# EAGLE design M710B (EAGLE 6.6.0)
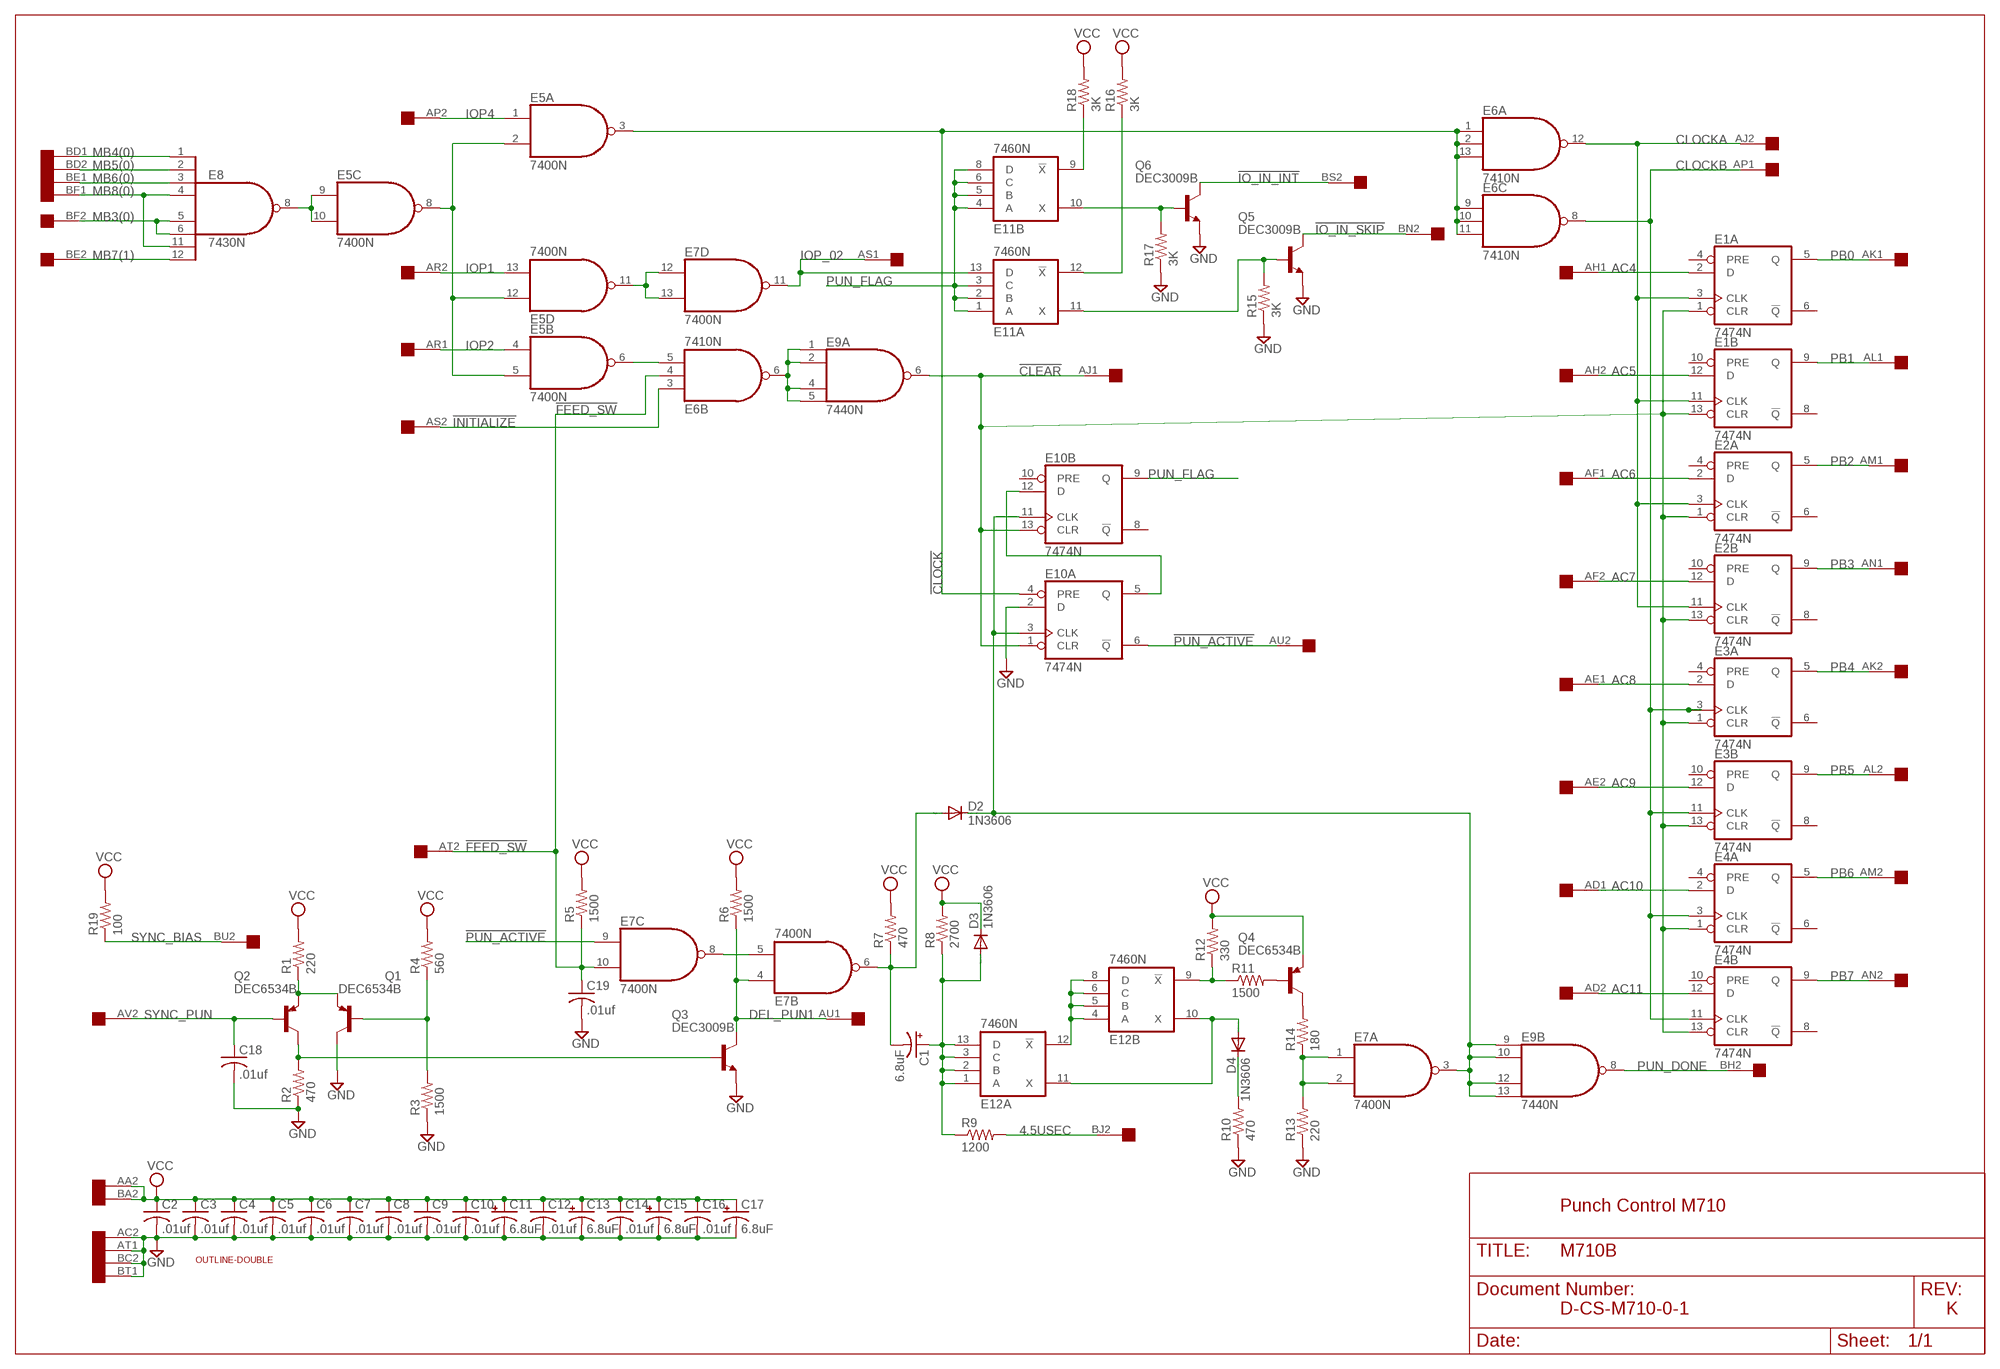
[diagram p0: schematic, sheet 1]

## Parts
C1  6.8uF  CPOL-USE15-5AXIAL  [E15-5]
C2  .01uf  C-US075-032X103  [C075-032X103]
C3  .01uf  C-US075-032X103  [C075-032X103]
C4  .01uf  C-US075-032X103  [C075-032X103]
C5  .01uf  C-US075-032X103  [C075-032X103]
C6  .01uf  C-US075-032X103  [C075-032X103]
C7  .01uf  C-US075-032X103  [C075-032X103]
C8  .01uf  C-US075-032X103  [C075-032X103]
C9  .01uf  C-US075-032X103  [C075-032X103]
C10  .01uf  C-US075-032X103  [C075-032X103]
C11  6.8uF  CPOL-USE15-5AXIAL  [E15-5]
C12  .01uf  C-US075-032X103  [C075-032X103]
C13  6.8uF  CPOL-USE15-5AXIAL  [E15-5]
C14  .01uf  C-US075-032X103  [C075-032X103]
C15  6.8uF  CPOL-USE15-5AXIAL  [E15-5]
C16  .01uf  C-US075-032X103  [C075-032X103]
C17  6.8uF  CPOL-USE15-5AXIAL  [E15-5]
C18  .01uf  C-US075-032X103  [C075-032X103]
C19  .01uf  C-US075-032X103  [C075-032X103]
D2  1N3606  DIODE-SOD61B  [SOD61B]
D3  1N3606  DIODE-SOD61B  [SOD61B]
D4  1N3606  DIODE-SOD61B  [SOD61B]
E1  7474N  74S74N  [DIL14]
E2  7474N  74S74N  [DIL14]
E3  7474N  74S74N  [DIL14]
E4  7474N  74S74N  [DIL14]
E5  7400N  [DIL14]
E6  7410N  [DIL14]
E7  7400N  [DIL14]
E8  7430N  [DIL14]
E9  7440N  [DIL14]
E10  7474N  74S74N  [DIL14]
E11  7460N  [DIL14]
E12  7460N  [DIL14]
Q1  DEC6534B  BC327-16-PNP-TO92-EBC  [TO92-EBC]
Q2  DEC6534B  BC327-16-PNP-TO92-EBC  [TO92-EBC]
Q3  DEC3009B  92-NPN-TO92-EBC  [TO92-EBC]
Q4  DEC6534B  BC327-16-PNP-TO92-EBC  [TO92-EBC]
Q5  DEC3009B  92-NPN-TO92-EBC  [TO92-EBC]
Q6  DEC3009B  -NPN-TO92-EBC  [TO92-EBC]
R1  220  R-US_0207/15  [0207/15]
R2  470  R-US_0207/15  [0207/15]
R3  1500  R-US_0207/15  [0207/15]
R4  560  R-US_0207/15  [0207/15]
R5  1500  R-US_0207/15  [0207/15]
R6  1500  R-US_0207/15  [0207/15]
R7  470  R-US_0207/15  [0207/15]
R8  2700  R-US_0207/15  [0207/15]
R9  1200  R-US_0207/15  [0207/15]
R10  470  R-US_0207/15  [0207/15]
R11  1500  R-US_0207/15  [0207/15]
R12  330  R-US_0207/15  [0207/15]
R13  220  R-US_0207/15  [0207/15]
R14  180  R-US_0207/15  [0207/15]
R15  3K  R-US_0207/15  [0207/15]
R16  3K  R-US_0207/15  [0207/15]
R17  3K  R-US_0207/15  [0207/15]
R18  3K  R-US_0207/15  [0207/15]
R19  100  R-US_0207/15  [0207/15]
U$1  OUTLINE-DOUBLE  [DOUBLE]
U$2  DOUBLE  [EDGE-CON4]

## Nets
4.5USEC: R9.2 U$2.BJ2
!CLEAR: E1.1(A:CLR) E1.13(B:CLR) E2.1(A:CLR) E2.13(B:CLR) E3.1(A:CLR) E3.13(B:CLR) E4.1(A:CLR) E4.13(B:CLR) E9.6(A:O) E10.1(A:CLR) E10.13(B:CLR) U$2.AJ1
!CLOCK: E5.3(A:O) E6.1(A:I0) E6.2(A:I1) E6.9(C:I0) E6.10(C:I1) E6.11(C:I2) E6.13(A:I2) E10.4(A:PRE)
!FEED_SW: C19.1 E6.4(B:I1) E7.10(C:I1) R5.1 U$2.AT2
!INITIALIZE: E6.3(B:I0) U$2.AS2
!IO_IN_INT: Q6.C U$2.BS2
!IO_IN_SKIP: Q5.C U$2.BN2
!PUN_ACTIVE: E7.9(C:I0) E10.6(A:!Q) U$2.AU2
AC4: E1.2(A:D) U$2.AH1
AC5: E1.12(B:D) U$2.AH2
AC6: E2.2(A:D) U$2.AF1
AC7: E2.12(B:D) U$2.AF2
AC8: E3.2(A:D) U$2.AE1
AC9: E3.12(B:D) U$2.AE2
AC10: E4.2(A:D) U$2.AD1
AC11: E4.12(B:D) U$2.AD2
CLOCKA: E1.3(A:CLK) E1.11(B:CLK) E2.3(A:CLK) E2.11(B:CLK) E6.12(A:O) U$2.AJ2
CLOCKB: E3.3(A:CLK) E3.11(B:CLK) E4.3(A:CLK) E4.11(B:CLK) E6.8(C:O) U$2.AP1
DEL_PUN1: E7.4(B:I0) Q3.C R6.1 U$2.AU1
GND [supply]: C2.2 C3.2 C4.2 C5.2 C6.2 C7.2 C8.2 C9.2 C10.2 C11.- C12.2 C13.- C14.2 C15.- C16.2 C17.- C18.2 C19.2 E10.2(A:D) Q1.C Q3.E Q5.E Q6.E R2.1 R3.1 R10.1 R13.1 R15.1 R17.1 U$2.AC2 U$2.AT1 U$2.BC2 U$2.BT1
IOP1: E5.13(D:I1) U$2.AR2
IOP2: E5.4(B:I0) U$2.AR1
IOP4: E5.1(A:I0) U$2.AP2
IOP_02: E7.11(D:O) E11.13(A:D) U$2.AS1
MB3(0): E8.5(I4) E8.6(I5) U$2.BF2
MB4(0): E8.1(I0) U$2.BD1
MB5(0): E8.2(I1) U$2.BD2
MB6(0): E8.3(I2) U$2.BE1
MB7(1): E8.12(I7) U$2.BE2
MB8(0): E8.4(I3) E8.11(I6) U$2.BF1
N$1: D2.C E7.3(A:O) E9.9(B:I0) E9.10(B:I1) E9.12(B:I2) E9.13(B:I3) E10.3(A:CLK) E10.11(B:CLK)
N$2: E6.6(B:O) E9.1(A:I0) E9.2(A:I1) E9.4(A:I2) E9.5(A:I3)
N$3: E12.4(B:A) E12.5(B:B) E12.6(B:C) E12.8(B:D) E12.12(A:!X)
N$4: C1.+ D3.A E12.1(A:A) E12.2(A:B) E12.3(A:C) E12.13(A:D) R8.1 R9.1
N$5: E5.9(C:I0) E5.10(C:I1) E8.8(O)
N$6: D4.A E12.10(B:X) E12.11(A:X)
N$7: E5.6(B:O) E6.5(B:I2)
N$8: E5.2(A:I1) E5.5(B:I1) E5.8(C:O) E5.12(D:I0)
N$9: E11.9(B:!X) R18.1
N$10: E11.12(A:!X) R16.1
N$11: E11.11(A:X) Q5.B R15.2
N$12: E11.10(B:X) Q6.B R17.2
N$13: D4.C R10.2
N$14: Q4.B R11.2
N$16: E5.11(D:O) E7.12(D:I0) E7.13(D:I1)
N$17: Q1.B R3.2 R4.1
N$18: Q2.C Q3.B R2.2
N$19: E12.9(B:!X) R11.1 R12.1
N$20: Q4.C R14.2
N$21: E7.1(A:I0) E7.2(A:I1) R13.2 R14.1
N$22: E7.5(B:I1) E7.8(C:O)
N$23: C1.- D2.A E7.6(B:O) R7.1
N$26: E10.5(A:Q) E10.12(B:D)
N$36: Q1.E Q2.E R1.1
PB0: E1.5(A:Q) U$2.AK1
PB1: E1.9(B:Q) U$2.AL1
PB2: E2.5(A:Q) U$2.AM1
PB3: E2.9(B:Q) U$2.AN1
PB4: E3.5(A:Q) U$2.AK2
PB5: E3.9(B:Q) U$2.AL2
PB6: E4.5(A:Q) U$2.AM2
PB7: E4.9(B:Q) U$2.AN2
PUN_DONE: E9.8(B:O) U$2.BH2
PUN_FLAG: E10.9(B:Q) E11.1(A:A) E11.2(A:B) E11.3(A:C) E11.4(B:A) E11.5(B:B) E11.6(B:C) E11.8(B:D)
SYNC_BIAS: R19.1 U$2.BU2
SYNC_PUN: C18.1 Q2.B U$2.AV2
VCC [supply]: C2.1 C3.1 C4.1 C5.1 C6.1 C7.1 C8.1 C9.1 C10.1 C11.+ C12.1 C13.+ C14.1 C15.+ C16.1 C17.+ D3.C Q4.E R1.2 R4.2 R5.2 R6.2 R7.2 R8.2 R12.2 R16.2 R18.2 R19.2 U$2.AA2 U$2.BA2
Unconnected: E1.4(A:PRE) E1.6(A:!Q) E1.8(B:!Q) E1.10(B:PRE) E2.4(A:PRE) E2.6(A:!Q) E2.8(B:!Q) E2.10(B:PRE) E3.4(A:PRE) E3.6(A:!Q) E3.8(B:!Q) E3.10(B:PRE) E4.4(A:PRE) E4.6(A:!Q) E4.8(B:!Q) E4.10(B:PRE) E9.3(3:NC) E9.11(11:NC) E10.8(B:!Q) E10.10(B:PRE) U$2.AA1 U$2.AB1 U$2.AB2 U$2.AC1 U$2.AV1 U$2.BA1 U$2.BB1 U$2.BB2 U$2.BC1 U$2.BH1 U$2.BJ1 U$2.BK1 U$2.BK2 U$2.BL1 U$2.BL2 U$2.BM1 U$2.BM2 U$2.BN1 U$2.BP1 U$2.BP2 U$2.BR1 U$2.BR2 U$2.BS1 U$2.BT2 U$2.BU1 U$2.BV1 U$2.BV2

## Notes on the sheet
- Punch Control M710
- D-CS-M710-0-1 | K

## Power pins joined to a net without a drawn wire
GND: E1.7(P:GND) E2.7(P:GND) E3.7(P:GND) E4.7(P:GND) E5.7(P:GND) E6.7(P:GND) E7.7(P:GND) E8.7(GND) E9.7(P:GND) E10.7(P:GND) E11.7(P:GND) E12.7(P:GND)
VCC: E1.14(P:VCC) E2.14(P:VCC) E3.14(P:VCC) E4.14(P:VCC) E5.14(P:VCC) E6.14(P:VCC) E7.14(P:VCC) E8.14(VCC) E9.14(P:VCC) E10.14(P:VCC) E11.14(P:VCC) E12.14(P:VCC)

## Library data of the parts
C1 C11 C13 C15 C17 = dec-con:CPOL-USE15-5AXIAL: 0.6" veresion of an electrolytic
C2-C10 C12 C14 C16 C18 C19 = rcl:C-US: CAPACITOR, American symbol
D2-D4 = diode:DIODE-: DIODE
E1-E4 E10 = 74xx-us:74*74: Dual D type positive edge triggered FLIP FLOP, preset and clear
E5 E7 = 74xx-us:74*00: Quad 2-input NAND gate
E6 = 74xx-us:74*10: Triple 3-input NAND gate
E8 = 74xx-us:74*30: 8-input NAND gate
E9 = dec-con:74*40: Dual 4-input NAND gate
E11 E12 = 74xx-us:74*60: Dual 4-input EXPANDER
Q1 Q2 Q4 = transistor:*-PNP-: PNP Transistror
Q3 Q5 Q6 = transistor:*-NPN-: NPN Transistror BF959 corrected 2008.03.06
R1-R19 = rcl:R-US_: RESISTOR, American symbol
U$1 = dec-con:OUTLINE-*: Board outlines for DEC boards.
U$2 = dec-con:DOUBLE: Double-Height DEC board

## Net classes
1 supply: width 0.813 mm

## Board
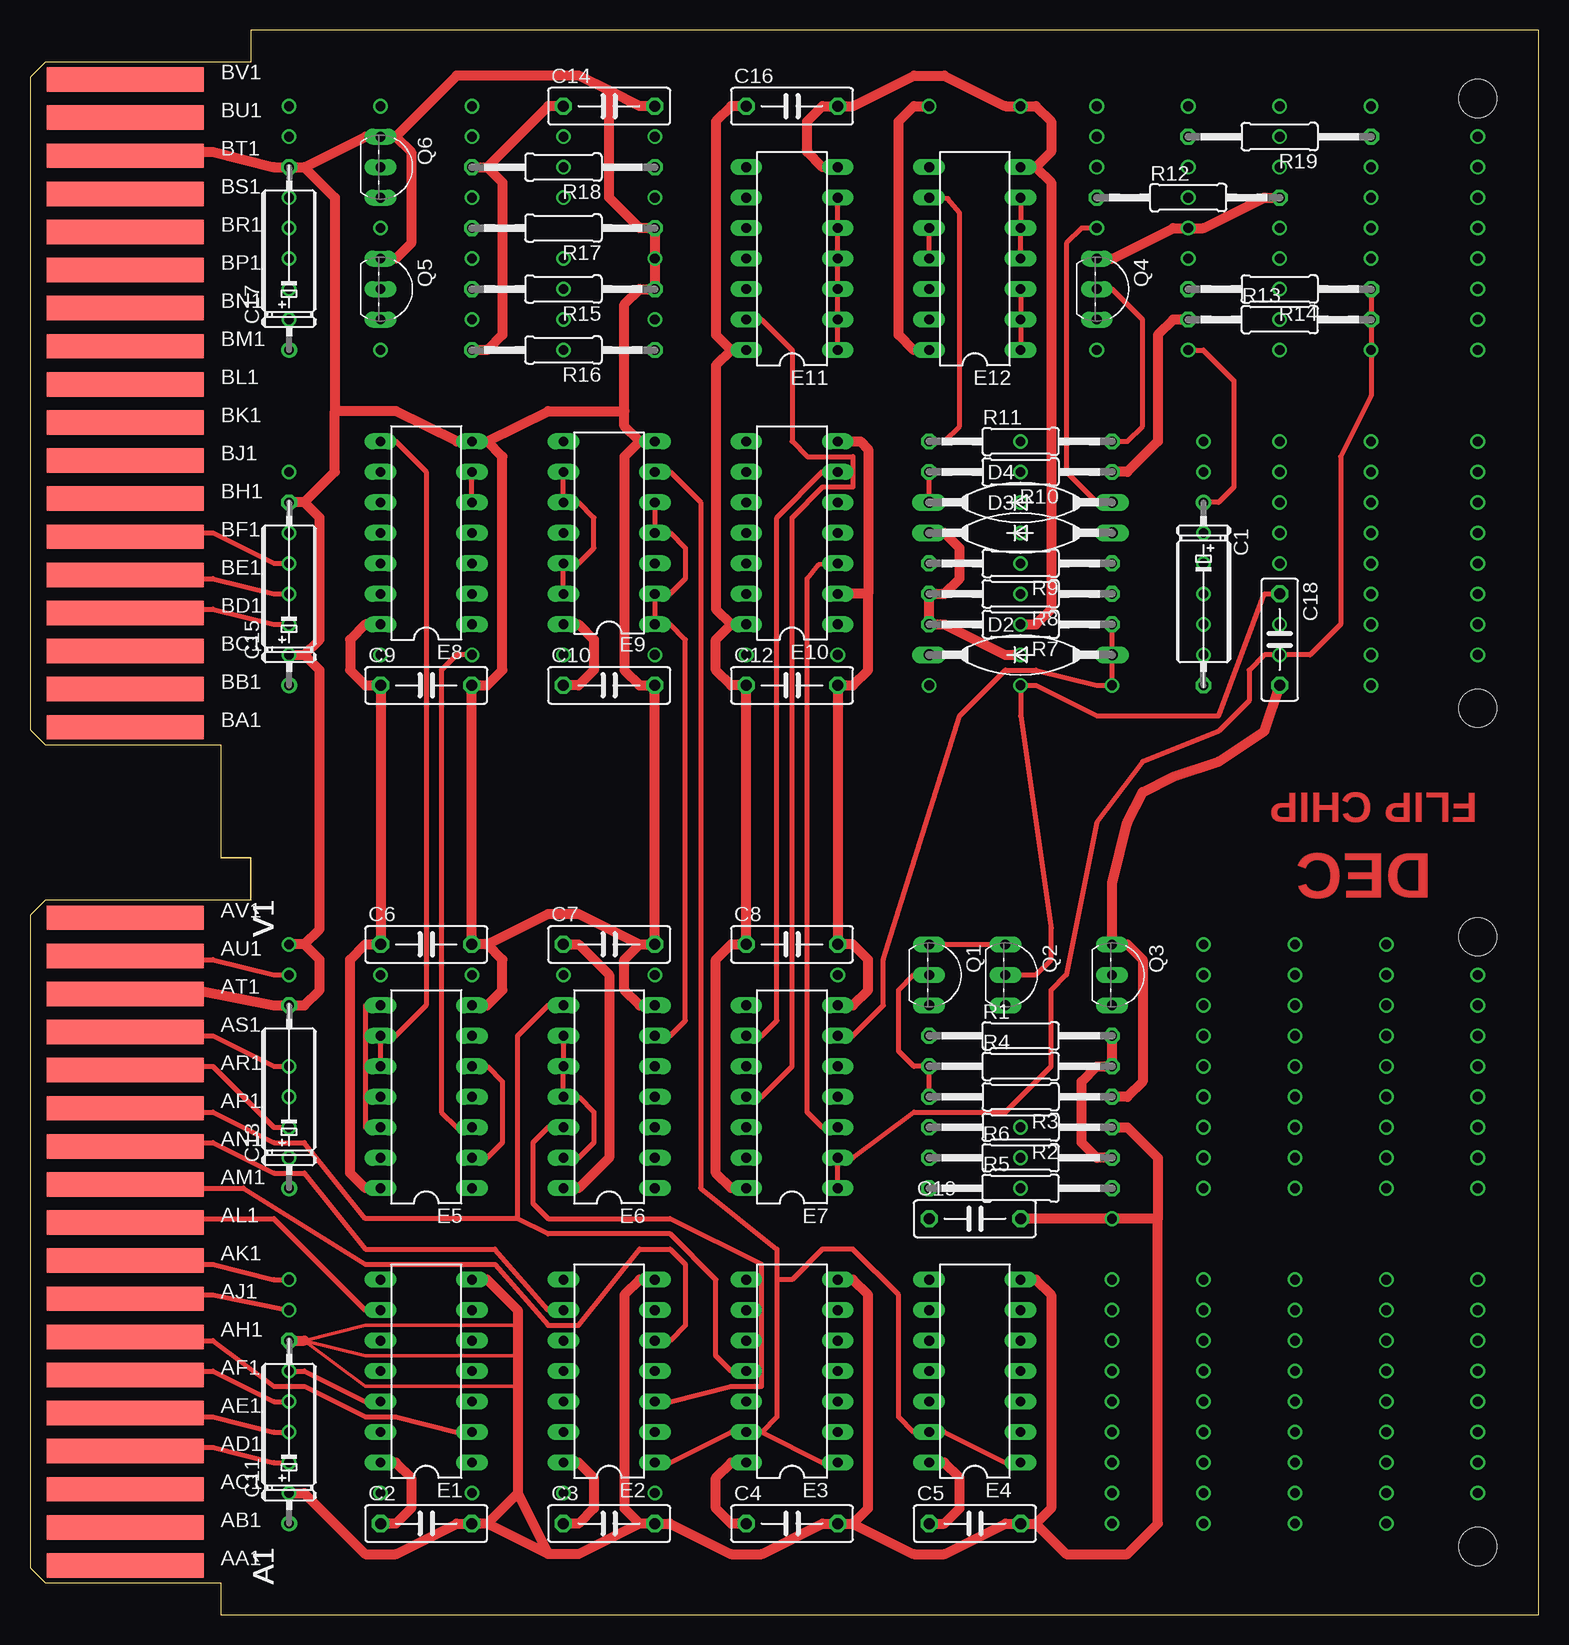
[diagram p1: board, top side]
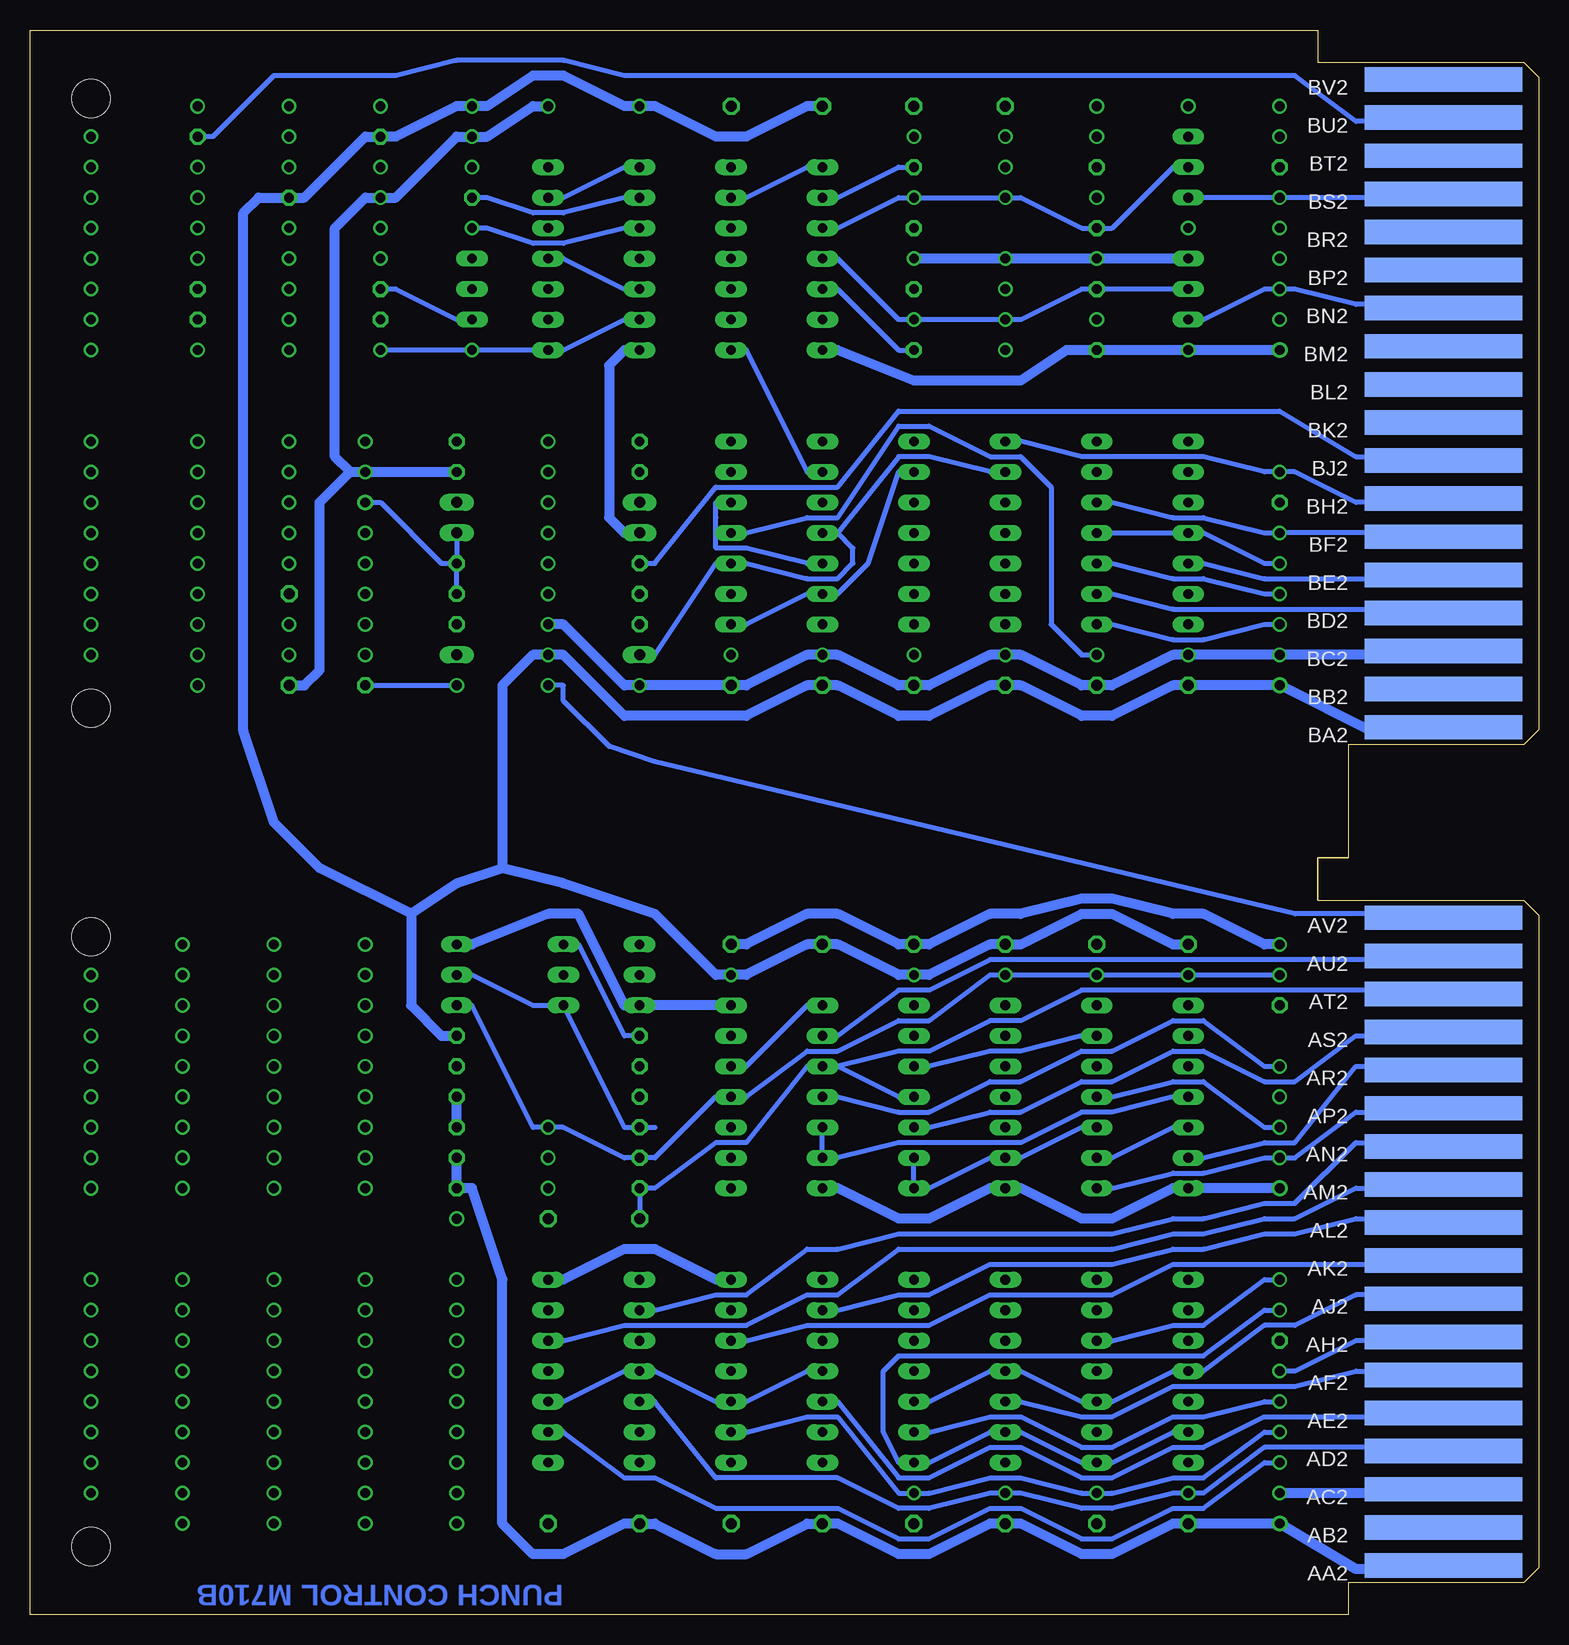
[diagram p2: board, bottom side, seen from below]

Size 125.73 x 132.08 mm. Coordinates in mm from the lower left corner, seen from the top.
Copper layers (1+16): Top 0.035mm / dielectric 1.5mm / Bottom 0.035mm
Design rules "16mils": minimum track width 16mil, minimum drill 32mil, track to track 15mil, track to pad 10mil, pad to pad 10mil, via to via 10mil, smd to smd 10mil, copper to edge 13mil, drill to drill 10mil, minimum pad ring 10mil, minimum via ring 8mil, stop-mask expansion 0mil, vias tented up to drill 0mil, thermal gap 10mil
vRestrict: area 31.8,108 to 41.9,125.7; area 49.5,108 to 59.7,125.7; area 67.3,108 to 77.5,125.7; area 85.1,108 to 95.3,125.7; area 102.9,108 to 113,125.7; area 31.8,80 to 41.9,97.8; area 49.5,80 to 59.7,97.8; area 67.3,80 to 77.5,97.8; area 85.1,80 to 95.3,97.8; area 31.8,34.3 to 41.9,52.1; area 49.5,34.3 to 59.7,52.1; area 67.3,34.3 to 77.5,52.1; area 85.1,34.3 to 95.3,52.1; area 102.9,11.4 to 113,29.2; area 85.1,11.4 to 95.3,29.2; area 49.5,11.4 to 59.7,29.2; area 31.8,11.4 to 41.9,29.2; area 67.3,11.4 to 77.5,29.2

### Footprints (pad centres in the part's own frame; a part is rotated, then mirrored left to right if it is on the bottom)
E15-5 = drill 0.813: + -7.62,0 | drill 0.813 octagon: - 7.62,0
C075-032X103 = drill 0.914 octagon: 1 -3.81,0; 2 3.81,0
SOD61B = drill 0.914 long: A 7.62,0; C -7.62,0
DIL14 = drill 0.813 long: 1 -7.62,-3.81; 2 -5.08,-3.81; 3 -2.54,-3.81; 4 0,-3.81; 5 2.54,-3.81; 6 5.08,-3.81; 7 7.62,-3.81; 8 7.62,3.81; 9 5.08,3.81; 10 2.54,3.81; 11 0,3.81; 12 -2.54,3.81; 13 -5.08,3.81; 14 -7.62,3.81
TO92-EBC = drill 0.813 long: B 0,-1.27; C 2.54,-1.27; E -2.54,-1.27
0207/15 = drill 0.813 octagon: 1 -7.62,0; 2 7.62,0
DOUBLE = hole 3.175: 120.65,56.515; 120.65,5.715; 120.65,75.565; 120.65,126.365
EDGE-CON4 = smd 13.106 x 2.032: AA1 7.938,4.128; AB1 7.938,7.303; AC1 7.938,10.477; AD1 7.938,13.652; AE1 7.938,16.828; AF1 7.938,20.003; AH1 7.938,23.177; AJ1 7.938,26.352; AK1 7.938,29.527; AL1 7.938,32.703; AM1 7.938,35.877; AN1 7.938,39.053; AP1 7.938,42.227; AR1 7.938,45.403; AS1 7.938,48.578; AT1 7.938,51.752; AU1 7.938,54.928; AV1 7.938,58.102; BA1 7.938,73.978; BB1 7.938,77.153; BC1 7.938,80.328; BD1 7.938,83.502; BE1 7.938,86.677; BF1 7.938,89.853; BH1 7.938,93.028; BJ1 7.938,96.203; BK1 7.938,99.377; BL1 7.938,102.552; BM1 7.938,105.728; BN1 7.938,108.903; BP1 7.938,112.078; BR1 7.938,115.252; BS1 7.938,118.427; BT1 7.938,121.603; BU1 7.938,124.778; BV1 7.938,127.953 | smd 13.106 x 2.032 bottom: AA2 7.938,4.128; AB2 7.938,7.303; AC2 7.938,10.477; AD2 7.938,13.652; AE2 7.938,16.828; AF2 7.938,20.003; AH2 7.938,23.177; AJ2 7.938,26.352; AK2 7.938,29.527; AL2 7.938,32.703; AM2 7.938,35.877; AN2 7.938,39.053; AP2 7.938,42.227; AR2 7.938,45.403; AS2 7.938,48.578; AT2 7.938,51.752; AU2 7.938,54.928; AV2 7.938,58.102; BA2 7.938,73.978; BB2 7.938,77.153; BC2 7.938,80.328; BD2 7.938,83.502; BE2 7.938,86.677; BF2 7.938,89.853; BH2 7.938,93.028; BJ2 7.938,96.203; BK2 7.938,99.377; BL2 7.938,102.552; BM2 7.938,105.728; BN2 7.938,108.903; BP2 7.938,112.078; BR2 7.938,115.252; BS2 7.938,118.427; BT2 7.938,121.603; BU2 7.938,124.778; BV2 7.938,127.953

### Placement (x,y rotation side)
C1  97.79,85.09 270 top
C2  33.02,7.62 0 top
C3  48.26,7.62 0 top
C4  63.5,7.62 0 top
C5  78.74,7.62 0 top
C6  33.02,55.88 0 top
C7  48.26,55.88 0 top
C8  63.5,55.88 0 top
C9  33.02,77.47 0 top
C10  48.26,77.47 0 top
C11  21.59,15.24 90 top
C12  63.5,77.47 0 top
C13  21.59,43.18 90 top
C14  48.26,125.73 0 top
C15  21.59,85.09 90 top
C16  63.5,125.73 0 top
C17  21.59,113.03 90 top
C18  104.14,81.28 270 top
C19  78.74,33.02 0 top
D2  82.55,80.01 0 top
D3  82.55,90.17 0 top
D4  82.55,92.71 0 top
E1  33.02,20.32 90 top
E2  48.26,20.32 90 top
E3  63.5,20.32 90 top
E4  78.74,20.32 90 top
E5  33.02,43.18 90 top
E6  48.26,43.18 90 top
E7  63.5,43.18 90 top
E8  33.02,90.17 90 top
E9  48.26,90.17 90 top
E10  63.5,90.17 90 top
E11  63.5,113.03 90 top
E12  78.74,113.03 90 top
Q1  76.2,53.34 270 top
Q2  82.55,53.34 270 top
Q3  91.44,53.34 270 top
Q4  90.17,110.49 270 top
Q5  30.48,110.49 270 top
Q6  30.48,120.65 270 top
R1  82.55,48.26 0 top
R2  82.55,40.64 180 top
R3  82.55,43.18 180 top
R4  82.55,45.72 0 top
R5  82.55,35.56 0 top
R6  82.55,38.1 0 top
R7  82.55,82.55 180 top
R8  82.55,85.09 180 top
R9  82.55,87.63 180 top
R10  82.55,95.25 180 top
R11  82.55,97.79 0 top
R12  96.52,118.11 0 top
R13  104.14,107.95 0 top
R14  104.14,110.49 180 top
R15  44.45,110.49 180 top
R16  44.45,105.41 180 top
R17  44.45,115.57 180 top
R18  44.45,120.65 180 top
R19  104.14,123.19 180 top
U$1  0,0 0 top
U$2  0,0 0 top

### Tracks (layer width: path | path; a pad name or v marks a point on that pad's centre or on a via)
4.5USEC
  Bottom 0.406: R9.2 73.66,87.63 68.58,93.98 58.42,93.98 53.34,100.33 21.59,100.33 15.24,96.52 8.89,96.52 U$2.BJ2
!CLEAR  (via drill 0.81)
  Top 0.406: U$2.AJ1 8.89,26.67 15.24,26.67 v21.59,25.4 | E2.1 53.34,12.7 58.42,15.24 E3.13 60.96,15.24 | E9.6 53.34,95.25 55.88,92.71 55.88,35.56 62.23,30.48 62.23,27.94 | 62.23,27.94 62.23,16.51 60.96,15.24 | E3.1 66.04,12.7 60.96,15.24 | 62.23,27.94 63.5,27.94 66.04,30.48 68.58,30.48 72.39,26.67 72.39,16.51 73.66,15.24 E4.13 76.2,15.24 81.28,12.7 E4.1
  Bottom 0.406: E1.13 30.48,15.24 35.56,12.7 E1.1 38.1,12.7 43.18,15.24 E2.13 45.72,15.24 50.8,12.7 E2.1 53.34,12.7 54.61,15.24 54.61,20.32 53.34,21.59 27.94,21.59 22.86,25.4 v21.59,25.4 | E10.1 66.04,82.55 60.96,85.09 E10.13 58.42,85.09 55.88,87.63 53.34,95.25 E9.6
!CLOCK  (via drill 0.81)
  Top 0.406: E6.9 E6.10 E6.11 45.72,43.18 46.99,41.91 46.99,39.37 45.72,38.1 E6.13 | v36.83,80.01 35.56,80.01 34.29,78.74 34.29,41.91 35.56,40.64 E5.3
  Bottom 0.406: E10.4 66.04,90.17 60.96,91.44 58.42,91.44 53.34,99.06 50.8,99.06 45.72,96.52 43.18,96.52 40.64,93.98 40.64,82.55 38.1,80.01 v36.83,80.01 | E5.3 38.1,40.64 43.18,38.1 E6.13 45.72,38.1 50.8,35.56 E6.1 E6.2
!FEED_SW
  Bottom 0.406: U$2.AT2 8.89,52.07 38.1,52.07 43.18,49.53 45.72,49.53 50.8,46.99 53.34,46.99 58.42,45.72 | 58.42,45.72 E7.10 60.96,45.72 66.04,39.37 68.58,39.37 73.66,35.56 R5.1 C19.1 | E6.4 53.34,43.18 58.42,45.72
!INITIALIZE
  Bottom 0.406: E6.3 50.8,40.64 45.72,41.91 43.18,41.91 38.1,44.45 35.56,44.45 30.48,46.99 27.94,46.99 22.86,44.45 20.32,44.45 15.24,48.26 8.89,48.26 U$2.AS2
!IO_IN_INT  (via drill 0.81)
  Bottom 0.406: U$2.BS2 10.16,118.11 v21.59,118.11 Q6.C
!IO_IN_SKIP  (via drill 0.81)
  Bottom 0.406: U$2.BN2 8.89,109.22 15.24,109.22 20.32,110.49 v21.59,110.49 22.86,110.49 27.94,107.95 Q5.C
!PUN_ACTIVE
  Top 0.406: E7.9 60.96,48.26 62.23,49.53 62.23,91.44 66.04,95.25 E10.6
  Bottom 0.406: U$2.AU2 10.16,54.61 45.72,54.61 50.8,52.07 53.34,52.07 58.42,48.26 E7.9
AC4
  Top 0.406: U$2.AH1 8.89,22.86 15.24,22.86 20.32,19.05 22.86,19.05 27.94,16.51 30.48,16.51 35.56,15.24 E1.2
AC5  (via drill 0.81)
  Top 0.406: v21.59,20.32 22.86,20.32 27.94,17.78 E1.12
  Bottom 0.406: U$2.AH2 10.16,22.86 15.24,22.86 20.32,20.32 v21.59,20.32
AC6  (via drill 0.81)
  Top 0.406: U$2.AF1 8.89,20.32 15.24,20.32 20.32,17.78 v21.59,17.78
  Bottom 0.406: E2.2 50.8,15.24 45.72,16.51 43.18,16.51 38.1,13.97 35.56,13.97 30.48,16.51 27.94,16.51 22.86,17.78 v21.59,17.78
AC7
  Bottom 0.406: E2.12 43.18,17.78 38.1,16.51 35.56,16.51 30.48,19.05 20.32,19.05 15.24,20.32 8.89,20.32 U$2.AF2
AC8  (via drill 0.81)
  Top 0.406: U$2.AE1 8.89,16.51 15.24,16.51 20.32,15.24 v21.59,15.24
  Bottom 0.406: E3.2 66.04,15.24 60.96,16.51 58.42,16.51 53.34,10.16 v52.07,10.16 50.8,10.16 45.72,11.43 43.18,11.43 38.1,10.16 v36.83,10.16 35.56,10.16 30.48,11.43 27.94,11.43 22.86,15.24 v21.59,15.24
AC9
  Bottom 0.406: E3.12 58.42,17.78 53.34,11.43 50.8,11.43 45.72,13.97 43.18,13.97 38.1,11.43 35.56,11.43 30.48,13.97 27.94,13.97 22.86,16.51 8.89,16.51 U$2.AE2
AC10  (via drill 0.81)
  Top 0.406: U$2.AD1 8.89,13.97 15.24,13.97 20.32,12.7 v21.59,12.7
  Bottom 0.406: E4.2 81.28,15.24 76.2,11.43 73.66,11.43 68.58,8.89 58.42,8.89 53.34,6.35 50.8,6.35 45.72,8.89 43.18,8.89 38.1,6.35 35.56,6.35 30.48,8.89 27.94,8.89 22.86,12.7 v21.59,12.7
AC11  (via drill 0.81)
  Bottom 0.406: U$2.AD2 10.16,13.97 22.86,13.97 27.94,10.16 v29.21,10.16 30.48,10.16 35.56,8.89 38.1,8.89 43.18,10.16 v44.45,10.16 45.72,10.16 50.8,8.89 53.34,8.89 58.42,11.43 68.58,11.43 73.66,17.78 E4.12
CLOCKA
  Top 0.406: E6.12 43.18,40.64 41.91,39.37 41.91,34.29 43.18,33.02 53.34,33.02 60.96,29.21 60.96,19.05 58.42,19.05 53.34,17.78 E2.3
  Bottom 0.406: U$2.AJ2 10.16,26.67 15.24,26.67 20.32,24.13 22.86,24.13 27.94,20.32 E1.11 30.48,20.32 35.56,17.78 E1.3 38.1,17.78 43.18,20.32 E2.11 45.72,20.32 50.8,17.78 E2.3
CLOCKB
  Top 0.406: U$2.AP1 8.89,41.91 15.24,41.91 20.32,39.37 22.86,39.37 27.94,33.02 40.64,33.02 | E3.11 58.42,20.32 57.15,21.59 57.15,27.94 53.34,31.75 43.18,31.75 40.64,33.02 | 40.64,33.02 40.64,48.26 43.18,50.8 E6.8
  Bottom 0.406: E4.3 81.28,17.78 76.2,20.32 E4.11 73.66,20.32 68.58,17.78 E3.3 66.04,17.78 60.96,20.32 E3.11
DEL_PUN1  (via drill 0.81)
  Top 0.406: U$2.AU1 10.16,54.61 15.24,54.61 20.32,53.34 v21.59,53.34
  Bottom 0.406: v21.59,53.34 v29.21,53.34 v36.83,53.34 v44.45,53.34 45.72,53.34 50.8,49.53 53.34,49.53 58.42,46.99 60.96,46.99 66.04,43.18 E7.4 68.58,43.18 73.66,38.1 R6.1 76.2,38.1 81.28,40.64 v82.55,40.64 83.82,40.64 88.9,50.8 Q3.C
GND  (via drill 0.81)
  Top 0.305: 22.86,22.86 27.94,24.13 40.64,24.13 | 22.86,22.86 27.94,21.59 40.64,21.59 | 22.86,22.86 27.94,19.05 40.64,19.05
  Top 0.813: U$2.BT1 8.89,121.92 15.24,121.92 20.32,120.65 C17.- 22.86,120.65 | 22.86,120.65 27.94,123.19 Q6.E 30.48,123.19 | 30.48,123.19 31.75,121.92 31.75,114.3 30.48,113.03 Q5.E | 30.48,123.19 35.56,128.27 45.72,128.27 48.26,127 | U$2.AT1 11.43,52.07 13.97,52.07 20.32,50.8 C13.- 22.86,50.8 24.13,52.07 24.13,54.61 22.86,55.88 | 22.86,55.88 v21.59,55.88 | E1.7 38.1,27.94 40.64,25.4 40.64,24.13 40.64,21.59 40.64,19.05 40.64,10.16 | 40.64,10.16 38.1,7.62 | 38.1,7.62 C2.2 35.56,7.62 30.48,5.08 27.94,5.08 22.86,10.16 v21.59,10.16 | 50.8,7.62 C3.2 53.34,7.62 58.42,5.08 60.96,5.08 66.04,7.62 C4.2 68.58,7.62 | 50.8,7.62 45.72,5.08 43.18,5.08 | 43.18,5.08 38.1,7.62 | 40.64,10.16 43.18,5.08 | 68.58,7.62 73.66,5.08 76.2,5.08 81.28,7.62 C5.2 83.82,7.62 | 68.58,7.62 69.85,8.89 69.85,26.67 68.58,27.94 E3.7 | 83.82,7.62 86.36,5.08 91.44,5.08 93.98,7.62 93.98,33.02 | 93.98,33.02 v90.17,33.02 C19.2 | R2.1 91.44,40.64 93.98,38.1 93.98,33.02 | R3.1 91.44,43.18 92.71,44.45 92.71,54.61 91.44,55.88 Q3.E 90.17,60.96 91.44,66.04 92.71,68.58 95.25,69.85 99.06,71.12 102.87,73.66 C18.2 | E4.7 83.82,27.94 85.09,26.67 85.09,8.89 83.82,7.62 | 22.86,55.88 24.13,57.15 24.13,78.74 22.86,80.01 | v21.59,80.01 22.86,80.01 | 22.86,80.01 24.13,81.28 24.13,91.44 22.86,92.71 | 22.86,92.71 C15.- | 22.86,92.71 25.4,95.25 25.4,100.33 | 25.4,100.33 30.48,100.33 35.56,97.79 E8.7 38.1,97.79 | 22.86,120.65 25.4,118.11 25.4,100.33 | C14.2 50.8,125.73 48.26,127 | 83.82,120.65 85.09,121.92 85.09,124.46 83.82,125.73 v82.55,125.73 81.28,125.73 76.2,128.27 73.66,128.27 68.58,125.73 C16.2 66.04,125.73 64.77,124.46 64.77,121.92 66.04,120.65 E11.7
  Top 0.813: 83.82,120.65 E12.7 | 83.82,120.65 85.09,119.38 85.09,83.82 83.82,82.55 v82.55,82.55 | E9.7 50.8,97.79 | 50.8,97.79 49.53,99.06 49.53,100.33 | 49.53,100.33 49.53,109.22 50.8,110.49 R15.1 v52.07,113.03 R17.1 50.8,115.57 48.26,118.11 48.26,127 | 38.1,97.79 43.18,100.33 49.53,100.33 | 69.85,85.09 69.85,78.74 68.58,77.47 C12.2 C8.2 68.58,55.88 69.85,54.61 69.85,52.07 68.58,50.8 E7.7 | 69.85,85.09 E10.2 | E10.7 69.22,97.79 69.85,97.16 69.85,85.09 | E5.7 38.1,50.8 39.37,52.07 39.37,54.61 38.1,55.88 | 38.1,55.88 C6.2 C9.2 38.1,77.47 39.37,78.74 39.37,96.52 38.1,97.79 | 38.1,55.88 43.18,58.42 45.72,58.42 50.8,55.88 | 50.8,55.88 C7.2 C10.2 50.8,77.47 49.53,78.74 49.53,96.52 50.8,97.79 | E2.7 50.8,27.94 49.53,26.67 49.53,8.89 50.8,7.62 | R13.1 95.25,107.95 93.98,106.68 93.98,97.79 91.44,95.25 R10.1 | E6.7 50.8,50.8 49.53,52.07 49.53,54.61 50.8,55.88 | C11.- 22.86,22.86
  Bottom 0.813: U$2.AC2 10.16,10.16 v21.59,10.16 | Q5.E v36.83,113.03 v44.45,113.03 v52.07,113.03 | E7.7 Q1.C 76.2,50.8 80.01,58.42 82.55,58.42 88.9,55.88 Q3.E | v21.59,55.88 22.86,55.88 27.94,58.42 30.48,58.42 35.56,59.69 38.1,59.69 43.18,58.42 45.72,58.42 50.8,55.88 C7.2 53.34,55.88 58.42,58.42 60.96,58.42 66.04,55.88 C8.2 | C18.2 102.87,77.47 101.6,78.74 101.6,92.71 99.06,95.25 | 99.06,95.25 v97.79,95.25 R10.1 | 99.06,95.25 100.33,96.52 100.33,115.57 97.79,118.11 v96.52,118.11 95.25,118.11 90.17,123.19 v88.9,123.19 87.63,123.19 83.82,125.73 v82.55,125.73 | U$2.BC2 10.16,80.01 v21.59,80.01 v29.21,80.01 30.48,80.01 35.56,77.47 C9.2 38.1,77.47 43.18,80.01 v44.45,80.01 45.72,80.01 50.8,77.47 C10.2 53.34,77.47 58.42,80.01 v59.69,80.01 60.96,80.01 66.04,77.47 C12.2 v74.93,77.47 76.2,77.47 81.28,82.55 v82.55,82.55 | E3.7 68.58,27.94 73.66,30.48 76.2,30.48 81.28,27.94 E4.7 | R2.1 R3.1
IOP1
  Bottom 0.406: E5.13 27.94,38.1 22.86,39.37 20.32,39.37 15.24,45.72 8.89,45.72 U$2.AR2
IOP2  (via drill 0.81)
  Top 0.406: U$2.AR1 10.16,45.72 15.24,45.72 20.32,40.64 v21.59,40.64
  Bottom 0.406: E5.4 35.56,43.18 30.48,44.45 27.94,44.45 22.86,40.64 v21.59,40.64
IOP4  (via drill 0.81)
  Bottom 0.406: E5.1 35.56,35.56 30.48,36.83 27.94,36.83 22.86,38.1 v21.59,38.1 20.32,38.1 15.24,41.91 8.89,41.91 U$2.AP2
IOP_02  (via drill 0.81)
  Top 0.406: U$2.AS1 8.89,48.26 15.24,48.26 20.32,45.72 v21.59,45.72 | E7.11 60.96,43.18 63.5,45.72 63.5,91.44 66.04,93.98 68.58,93.98 68.58,96.52 64.77,96.52 63.5,97.79 63.5,105.41 60.96,107.95 E11.13
  Bottom 0.406: E7.11 58.42,43.18 53.34,41.91 50.8,41.91 45.72,44.45 43.18,44.45 38.1,46.99 35.56,46.99 30.48,49.53 27.94,49.53 22.86,45.72 v21.59,45.72
MB3(0)  (via drill 0.81)
  Top 0.406: E8.5 E8.6
  Bottom 0.406: U$2.BF2 10.16,90.17 v21.59,90.17 22.86,90.17 27.94,91.44 30.48,91.44 35.56,92.71 E8.5
MB4(0)  (via drill 0.81)
  Top 0.406: U$2.BD1 8.89,83.82 15.24,83.82 20.32,82.55 v21.59,82.55
  Bottom 0.406: E8.1 35.56,82.55 30.48,81.28 27.94,81.28 22.86,82.55 v21.59,82.55
MB5(0)
  Bottom 0.406: E8.2 35.56,85.09 30.48,83.82 8.89,83.82 U$2.BD2
MB6(0)  (via drill 0.81)
  Top 0.406: U$2.BE1 8.89,86.36 15.24,86.36 20.32,85.09 v21.59,85.09
  Bottom 0.406: E8.3 35.56,87.63 30.48,86.36 27.94,86.36 22.86,85.09 v21.59,85.09
MB7(1)
  Bottom 0.406: E8.12 27.94,87.63 22.86,86.36 8.89,86.36 U$2.BE2
MB8(0)  (via drill 0.81)
  Top 0.406: U$2.BF1 8.89,90.17 15.24,90.17 20.32,87.63 v21.59,87.63
  Bottom 0.406: E8.4 E8.11 27.94,90.17 22.86,87.63 v21.59,87.63
N$1
  Top 0.406: E7.3 66.04,40.64 64.77,41.91 64.77,86.36 65.74,87.56 E10.3 | E9.13 E9.12 45.72,87.63 46.99,88.9 46.99,91.44 45.72,92.71 E9.10 E9.9
  Bottom 0.406: D2.C 73.66,80.01 68.58,87.63 E10.3 66.04,87.63 60.96,86.36 58.42,86.36 57.15,87.63 57.15,88.9 58.42,90.17 | 58.42,90.17 E10.11 | E9.9 45.72,95.25 50.8,96.52 53.34,96.52 58.42,90.17
N$2
  Top 0.406: E6.6 53.34,48.26 54.61,49.53 54.61,81.28 53.34,82.55 E9.1 E9.2 53.34,85.09 54.61,86.36 54.61,88.9 53.34,90.17 E9.4 E9.5
N$3
  Top 0.406: E12.6 E12.5 E12.4
  Bottom 0.406: E12.8 76.2,120.65 81.28,118.11 E12.6 | E12.12 76.2,110.49 81.28,113.03 E12.4
N$4  (via drill 0.81)
  Top 0.406: E12.3 E12.2 E12.1 | v96.52,105.41 97.79,105.41 100.33,102.87 100.33,93.98 99.06,92.71 C1.+
  Bottom 0.406: E12.13 76.2,107.95 81.28,105.41 E12.1 v88.9,105.41 v96.52,105.41 | C1.+ 96.52,92.71 91.44,87.63 R9.1 | R8.1 R9.1 | D3.A R9.1
N$5
  Top 0.406: E8.8 30.48,97.79 33.02,95.25 33.02,50.8 30.48,48.26 E5.9 E5.10
N$6  (via drill 0.81)
  Top 0.406: v88.9,115.57 87.63,115.57 86.36,114.3 86.36,95.25 88.9,92.71 D4.A | E12.11 E12.10
  Bottom 0.406: E12.10 76.2,115.57 81.28,114.3 83.82,114.3 87.63,115.57 v88.9,115.57
N$7
  Bottom 0.406: E5.6 38.1,48.26 43.18,46.99 45.72,46.99 50.8,45.72 E6.5
N$8
  Top 0.406: E5.5 38.1,45.72 39.37,44.45 39.37,39.37 38.1,38.1 E5.2 | E5.8 27.94,50.8 27.94,40.64 E5.12
  Bottom 0.406: E5.12 30.48,40.64 35.56,38.1 E5.2
N$9
  Bottom 0.406: E11.9 58.42,118.11 53.34,120.65 R18.1
N$10
  Bottom 0.406: E11.12 58.42,110.49 53.34,105.41 R16.1
N$11  (via drill 0.81)
  Bottom 0.406: Q5.B R15.2 38.1,110.49 43.18,107.95 v44.45,107.95 v52.07,107.95 53.34,107.95 58.42,113.03 E11.11
N$12  (via drill 0.81)
  Bottom 0.406: E11.10 58.42,115.57 53.34,118.11 v52.07,118.11 v44.45,118.11 43.18,118.11 38.1,115.57 R17.2 35.56,115.57 30.48,120.65 Q6.B
N$13
  Top 0.406: D4.C R10.2
N$14
  Top 0.406: R11.2 91.44,97.79 92.71,99.06 92.71,107.95 90.17,110.49 Q4.B
N$15  (via drill 0.81)
  other vias: 88.9,120.65
N$16
  Bottom 0.406: E5.11 30.48,43.18 35.56,41.91 38.1,41.91 43.18,39.37 53.34,39.37 58.42,38.1 E7.13 E7.12
N$17
  Top 0.406: R3.2 R4.1 73.66,45.72 72.39,46.99 72.39,52.07 73.66,53.34 Q1.B
N$18
  Bottom 0.406: Q3.B 88.9,53.34 83.82,50.8 Q2.C 76.2,40.64 R2.2 73.66,40.64
N$19
  Top 0.406: R11.1 76.2,97.79 77.47,99.06 77.47,116.84 76.5,118.03 E12.9
  Bottom 0.406: E12.9 76.2,118.11 81.28,116.84 83.82,116.84 87.63,118.11 R12.1
N$20
  Bottom 0.406: Q4.C 90.17,107.95 95.25,110.49 R14.2
N$21  (via drill 0.81)
  Top 0.406: R14.1 R13.2 v111.76,105.41 111.76,101.6 109.22,96.52 109.22,82.55 106.68,80.01 v104.14,80.01 102.87,80.01 101.6,78.74 101.6,76.2 99.06,73.66 92.71,71.12 88.9,66.04 86.36,53.34 85.09,52.07 85.09,45.72 81.28,41.91 73.66,41.91 68.58,38.1 E7.2 E7.1
N$22
  Bottom 0.406: E7.8 60.96,50.8 66.04,45.72 E7.5
N$23  (via drill 0.81)
  Top 0.406: R7.1 D2.A v90.17,77.47 88.9,77.47 83.82,78.74 81.28,78.74 77.47,74.93 71.12,54.61 71.12,50.8 68.58,48.26 E7.6
  Bottom 0.406: C1.- v90.17,77.47
N$24  (via drill 0.81)
  other vias: 96.52,125.73
N$25  (via drill 0.81)
  other vias: 104.14,125.73
N$26
  Bottom 0.406: E10.12 60.96,87.63 66.04,88.9 68.58,88.9 68.58,91.44 68.58,92.71 E10.5
N$27  (via drill 0.81)
  other vias: 111.76,125.73
N$28  (via drill 0.81)
  other vias: 90.17,7.62
N$29  (via drill 0.81)
  other vias: 90.17,10.16
N$30  (via drill 0.81)
  other vias: 90.17,12.7
N$31  (via drill 0.81)
  other vias: 90.17,15.24
N$32  (via drill 0.81)
  other vias: 90.17,17.78
N$33  (via drill 0.81)
  other vias: 90.17,20.32
N$34  (via drill 0.81)
  other vias: 90.17,22.86
N$35  (via drill 0.81)
  other vias: 90.17,25.4
N$36
  Top 0.406: Q1.E Q2.E
  Bottom 0.406: R1.1 76.2,48.26 80.01,55.88 Q2.E
N$37  (via drill 0.81)
  other vias: 90.17,27.94
N$38  (via drill 0.81)
  other vias: 97.79,27.94
N$39  (via drill 0.81)
  other vias: 97.79,7.62
N$40  (via drill 0.81)
  other vias: 97.79,10.16
N$41  (via drill 0.81)
  other vias: 97.79,12.7
N$42  (via drill 0.81)
  other vias: 97.79,15.24
N$43  (via drill 0.81)
  other vias: 97.79,17.78
N$44  (via drill 0.81)
  other vias: 97.79,20.32
N$45  (via drill 0.81)
  other vias: 97.79,22.86
N$46  (via drill 0.81)
  other vias: 97.79,25.4
N$47  (via drill 0.81)
  other vias: 105.41,7.62
N$48  (via drill 0.81)
  other vias: 113.03,7.62
N$49  (via drill 0.81)
  other vias: 113.03,10.16
N$50  (via drill 0.81)
  other vias: 105.41,10.16
N$51  (via drill 0.81)
  other vias: 105.41,12.7
N$52  (via drill 0.81)
  other vias: 105.41,15.24
N$53  (via drill 0.81)
  other vias: 105.41,17.78
N$54  (via drill 0.81)
  other vias: 105.41,20.32
N$55  (via drill 0.81)
  other vias: 105.41,22.86
N$56  (via drill 0.81)
  other vias: 113.03,22.86
N$57  (via drill 0.81)
  other vias: 113.03,20.32
N$58  (via drill 0.81)
  other vias: 113.03,17.78
N$59  (via drill 0.81)
  other vias: 113.03,15.24
N$60  (via drill 0.81)
  other vias: 113.03,12.7
N$61  (via drill 0.81)
  other vias: 105.41,25.4
N$62  (via drill 0.81)
  other vias: 113.03,25.4
N$63  (via drill 0.81)
  other vias: 113.03,27.94
N$64  (via drill 0.81)
  other vias: 105.41,27.94
N$65  (via drill 0.81)
  other vias: 97.79,35.56
N$66  (via drill 0.81)
  other vias: 97.79,38.1
N$67  (via drill 0.81)
  other vias: 97.79,40.64
N$68  (via drill 0.81)
  other vias: 97.79,43.18
N$69  (via drill 0.81)
  other vias: 97.79,45.72
N$70  (via drill 0.81)
  other vias: 97.79,48.26
N$71  (via drill 0.81)
  other vias: 97.79,50.8
N$72  (via drill 0.81)
  other vias: 97.79,53.34
N$73  (via drill 0.81)
  other vias: 97.79,55.88
N$74  (via drill 0.81)
  other vias: 105.41,55.88
N$75  (via drill 0.81)
  other vias: 105.41,53.34
N$76  (via drill 0.81)
  other vias: 105.41,50.8
N$77  (via drill 0.81)
  other vias: 105.41,48.26
N$78  (via drill 0.81)
  other vias: 113.03,55.88
N$79  (via drill 0.81)
  other vias: 113.03,53.34
N$80  (via drill 0.81)
  other vias: 113.03,50.8
N$81  (via drill 0.81)
  other vias: 113.03,48.26
N$82  (via drill 0.81)
  other vias: 113.03,45.72
N$83  (via drill 0.81)
  other vias: 113.03,43.18
N$84  (via drill 0.81)
  other vias: 113.03,40.64
N$85  (via drill 0.81)
  other vias: 105.41,40.64
N$86  (via drill 0.81)
  other vias: 105.41,43.18
N$87  (via drill 0.81)
  other vias: 105.41,45.72
N$88  (via drill 0.81)
  other vias: 105.41,35.56
N$89  (via drill 0.81)
  other vias: 105.41,38.1
N$90  (via drill 0.81)
  other vias: 113.03,38.1
N$91  (via drill 0.81)
  other vias: 113.03,35.56
N$92  (via drill 0.81)
  other vias: 21.59,43.18
N$93  (via drill 0.81)
  other vias: 21.59,107.95
N$94  (via drill 0.81)
  other vias: 44.45,120.65
N$95  (via drill 0.81)
  other vias: 44.45,123.19
N$96  (via drill 0.81)
  other vias: 52.07,123.19
N$97  (via drill 0.81)
  other vias: 44.45,110.49
N$98  (via drill 0.81)
  other vias: 36.83,107.95
N$99  (via drill 0.81)
  other vias: 36.83,118.11
N$100  (via drill 0.81)
  other vias: 36.83,123.19
N$101  (via drill 0.81)
  other vias: 36.83,125.73
N$102  (via drill 0.81)
  other vias: 29.21,125.73
N$103  (via drill 0.81)
  other vias: 29.21,115.57
N$104  (via drill 0.81)
  other vias: 96.52,120.65
N$105  (via drill 0.81)
  other vias: 52.07,80.01
N$106  (via drill 0.81)
  other vias: 96.52,113.03
N$107  (via drill 0.81)
  other vias: 104.14,105.41
N$108  (via drill 0.81)
  other vias: 104.14,107.95
N$109  (via drill 0.81)
  other vias: 104.14,110.49
N$110  (via drill 0.81)
  other vias: 104.14,113.03
N$111  (via drill 0.81)
  other vias: 104.14,115.57
N$112  (via drill 0.81)
  other vias: 104.14,120.65
N$113  (via drill 0.81)
  other vias: 104.14,123.19
N$114  (via drill 0.81)
  other vias: 111.76,120.65
N$115  (via drill 0.81)
  other vias: 111.76,118.11
N$116  (via drill 0.81)
  other vias: 111.76,115.57
N$117  (via drill 0.81)
  other vias: 111.76,113.03
N$118  (via drill 0.81)
  other vias: 104.14,97.79
N$119  (via drill 0.81)
  other vias: 104.14,87.63
N$120  (via drill 0.81)
  other vias: 104.14,90.17
N$121  (via drill 0.81)
  other vias: 104.14,92.71
N$122  (via drill 0.81)
  other vias: 104.14,95.25
N$123  (via drill 0.81)
  other vias: 67.31,80.01
N$124  (via drill 0.81)
  other vias: 104.14,82.55
N$125  (via drill 0.81)
  other vias: 111.76,77.47
N$126  (via drill 0.81)
  other vias: 111.76,80.01
N$127  (via drill 0.81)
  other vias: 111.76,82.55
N$128  (via drill 0.81)
  other vias: 111.76,85.09
N$129  (via drill 0.81)
  other vias: 111.76,87.63
N$130  (via drill 0.81)
  other vias: 111.76,90.17
N$131  (via drill 0.81)
  other vias: 111.76,97.79
N$132  (via drill 0.81)
  other vias: 111.76,95.25
N$133  (via drill 0.81)
  other vias: 111.76,92.71
N$134  (via drill 0.81)
  other vias: 44.45,105.41
N$135  (via drill 0.81)
  other vias: 21.59,113.03
N$136  (via drill 0.81)
  other vias: 21.59,115.57
N$137  (via drill 0.81)
  other vias: 21.59,123.19
N$138  (via drill 0.81)
  other vias: 21.59,125.73
N$139  (via drill 0.81)
  other vias: 82.55,35.56
N$140  (via drill 0.81)
  other vias: 82.55,38.1
N$141  (via drill 0.81)
  other vias: 120.65,10.16
N$142  (via drill 0.81)
  other vias: 120.65,12.7
N$143  (via drill 0.81)
  other vias: 120.65,15.24
N$144  (via drill 0.81)
  other vias: 120.65,17.78
N$145  (via drill 0.81)
  other vias: 120.65,27.94
N$146  (via drill 0.81)
  other vias: 120.65,25.4
N$147  (via drill 0.81)
  other vias: 120.65,22.86
N$148  (via drill 0.81)
  other vias: 120.65,20.32
N$149  (via drill 0.81)
  other vias: 120.65,35.56
N$150  (via drill 0.81)
  other vias: 120.65,38.1
N$151  (via drill 0.81)
  other vias: 120.65,40.64
N$152  (via drill 0.81)
  other vias: 120.65,43.18
N$153  (via drill 0.81)
  other vias: 120.65,45.72
N$154  (via drill 0.81)
  other vias: 120.65,48.26
N$155  (via drill 0.81)
  other vias: 120.65,50.8
N$156  (via drill 0.81)
  other vias: 120.65,53.34
N$157  (via drill 0.81)
  other vias: 120.65,80.01
N$158  (via drill 0.81)
  other vias: 120.65,82.55
N$159  (via drill 0.81)
  other vias: 120.65,85.09
N$160  (via drill 0.81)
  other vias: 120.65,87.63
N$161  (via drill 0.81)
  other vias: 120.65,90.17
N$162  (via drill 0.81)
  other vias: 120.65,97.79
N$163  (via drill 0.81)
  other vias: 120.65,95.25
N$164  (via drill 0.81)
  other vias: 120.65,92.71
N$165  (via drill 0.81)
  other vias: 120.65,123.19
N$166  (via drill 0.81)
  other vias: 120.65,120.65
N$167  (via drill 0.81)
  other vias: 120.65,118.11
N$168  (via drill 0.81)
  other vias: 120.65,115.57
N$169  (via drill 0.81)
  other vias: 120.65,113.03
N$170  (via drill 0.81)
  other vias: 120.65,110.49
N$171  (via drill 0.81)
  other vias: 120.65,107.95
N$172  (via drill 0.81)
  other vias: 120.65,105.41
N$173  (via drill 0.81)
  other vias: 82.55,85.09
N$174  (via drill 0.81)
  other vias: 82.55,87.63
N$175  (via drill 0.81)
  other vias: 82.55,90.17
N$176  (via drill 0.81)
  other vias: 82.55,92.71
N$177  (via drill 0.81)
  other vias: 82.55,95.25
N$178  (via drill 0.81)
  other vias: 82.55,97.79
N$179  (via drill 0.81)
  other vias: 97.79,80.01
N$180  (via drill 0.81)
  other vias: 97.79,82.55
N$181  (via drill 0.81)
  other vias: 97.79,85.09
N$182  (via drill 0.81)
  other vias: 97.79,87.63
N$183  (via drill 0.81)
  other vias: 97.79,90.17
N$184  (via drill 0.81)
  other vias: 97.79,97.79
PB0  (via drill 0.81)
  Top 0.406: U$2.AK1 8.89,29.21 15.24,29.21 20.32,27.94 v21.59,27.94
  Bottom 0.406: E1.5 35.56,22.86 30.48,24.13 27.94,24.13 22.86,27.94 v21.59,27.94
PB1
  Top 0.406: U$2.AL1 8.89,33.02 20.32,33.02 27.94,25.4 E1.9
PB2
  Top 0.406: U$2.AM1 8.89,35.56 17.78,35.56 27.94,29.21 38.1,29.21 38.74,29.21 43.18,24.13 45.72,24.13 50.8,30.48 53.34,30.48 54.61,29.21 54.61,24.13 53.34,22.86 E2.5
PB3
  Top 0.406: U$2.AN1 10.16,39.37 15.24,39.37 20.32,36.83 22.86,36.83 27.94,30.48 38.74,30.48 43.18,25.4 E2.9
PB4
  Bottom 0.406: E3.5 66.04,22.86 60.96,24.13 50.8,24.13 45.72,26.67 35.56,26.67 30.48,29.21 8.89,29.21 U$2.AK2
PB5
  Bottom 0.406: E3.9 58.42,25.4 53.34,26.67 50.8,26.67 45.72,29.21 35.56,29.21 30.48,30.48 27.94,30.48 22.86,31.75 20.32,31.75 15.24,33.02 8.89,33.02 U$2.AL2
PB6
  Bottom 0.406: E4.5 81.28,22.86 76.2,24.13 66.04,24.13 60.96,26.67 58.42,26.67 53.34,30.48 35.56,30.48 30.48,31.75 27.94,31.75 22.86,33.02 20.32,33.02 15.24,35.56 8.89,35.56 U$2.AM2
PB7
  Bottom 0.406: E4.9 73.66,25.4 68.58,26.67 66.04,26.67 60.96,30.48 58.42,30.48 53.34,31.75 35.56,31.75 30.48,33.02 27.94,33.02 22.86,34.29 20.32,34.29 15.24,39.37 8.89,39.37 U$2.AN2
PUN_DONE  (via drill 0.81)
  Bottom 0.406: U$2.BH2 8.89,92.71 15.24,92.71 20.32,95.25 v21.59,95.25 22.86,95.25 27.94,96.52 38.1,96.52 43.18,97.79 E9.8
PUN_FLAG
  Top 0.406: E11.1 E11.2 E11.3 E11.4 E11.5 E11.6
  Bottom 0.406: E10.9 60.96,95.25 66.04,105.41 E11.1 | E11.8 60.96,120.65 66.04,118.11 E11.6
SYNC_BIAS
  Bottom 0.406: U$2.BU2 10.16,124.46 15.24,124.46 20.32,128.27 76.2,128.27 81.28,129.54 90.17,129.54 95.25,128.27 105.41,128.27 110.49,123.19 R19.1
SYNC_PUN  (via drill 0.81)
  Top 0.406: C18.1 102.87,85.09 99.06,74.93 88.9,74.93 83.82,77.47 v82.55,77.47 82.55,74.93 85.09,57.15 85.09,54.61 83.82,53.34 Q2.B
  Bottom 0.406: U$2.AV2 8.89,58.42 20.32,58.42 73.66,71.12 77.47,72.39 81.28,76.2 81.28,77.47 v82.55,77.47
VCC  (via drill 0.81)
  Top 0.813: R18.2 38.1,120.65 | 38.1,120.65 39.37,119.38 39.37,106.68 38.1,105.41 R16.2 | v82.55,80.01 81.28,80.01 76.2,82.55 R7.2 R8.2 76.2,85.09 77.47,86.36 77.47,88.9 76.2,90.17 D3.C | E8.14 27.94,82.55 26.67,81.28 26.67,78.74 27.94,77.47 C9.1 C6.1 27.94,55.88 26.67,54.61 26.67,36.83 27.94,35.56 E5.14 | R6.2 88.9,38.1 87.63,39.37 87.63,44.45 88.9,45.72 R4.2 R1.2 | C16.1 58.42,125.73 57.15,124.46 57.15,106.68 58.42,105.41 | 58.42,105.41 E11.14 | 58.42,105.41 57.15,104.14 57.15,83.82 58.42,82.55 | 58.42,82.55 E10.14 | 58.42,82.55 57.15,81.28 57.15,78.74 58.42,77.47 C12.1 C8.1 58.42,55.88 57.15,54.61 57.15,36.83 58.42,35.56 E7.14 | E1.14 30.48,12.7 31.75,11.43 31.75,8.89 30.48,7.62 C2.1 | E2.14 45.72,12.7 46.99,11.43 46.99,8.89 45.72,7.62 C3.1 | C4.1 58.42,7.62 57.15,8.89 57.15,11.43 58.42,12.7 E3.14 | Q4.E 90.17,113.03 95.25,115.57 v96.52,115.57 97.79,115.57 102.87,118.11 R12.2 | E12.14 73.66,105.41 72.39,106.68 72.39,124.46 73.66,125.73 v74.93,125.73 | C14.1 43.18,125.73 38.1,120.65 | C7.1 45.72,55.88 48.26,53.34 48.26,38.1 45.72,35.56 E6.14 | E9.14 45.72,82.55 46.99,81.28 46.99,78.74 45.72,77.47 C10.1 | C5.1 76.2,7.62 77.47,8.89 77.47,11.43 76.2,12.7 E4.14
  Bottom 0.813: U$2.AA2 8.89,4.13 8.89,3.81 15.24,3.81 C11.+ C2.1 30.48,7.62 35.56,5.08 38.1,5.08 43.18,7.62 C3.1 45.72,7.62 50.8,5.08 53.34,5.08 58.42,7.62 C4.1 60.96,7.62 66.04,5.08 68.58,5.08 73.66,7.62 C5.1 76.2,7.62 81.28,5.08 83.82,5.08 86.36,7.62 86.36,27.94 88.9,35.56 R5.2 R6.2 | C17.+ v29.21,105.41 R16.2 39.37,105.41 43.18,102.87 52.07,102.87 58.42,105.41 E11.14 | C16.1 60.96,125.73 66.04,123.19 68.58,123.19 73.66,125.73 v74.93,125.73 76.2,125.73 81.28,128.27 83.82,128.27 87.63,125.73 v88.9,125.73 90.17,125.73 95.25,123.19 R19.2 97.79,123.19 102.87,118.11 R12.2 106.68,118.11 107.95,116.84 107.95,73.66 105.41,66.04 101.6,62.23 93.98,58.42 | U$2.BA2 8.89,73.66 13.97,73.66 C15.+ C9.1 30.48,77.47 35.56,74.93 38.1,74.93 43.18,77.47 C10.1 45.72,77.47 50.8,74.93 53.34,74.93 58.42,77.47 C12.1 60.96,77.47 66.04,74.93 76.2,74.93 81.28,80.01 v82.55,80.01 83.82,80.01 86.36,77.47 86.36,62.23 | 86.36,62.23 90.17,60.96 93.98,58.42 | 93.98,58.42 93.98,50.8 91.44,48.26 R1.2 | C6.1 30.48,55.88 35.56,58.42 38.1,58.42 43.18,55.88 C7.1 45.72,55.88 50.8,53.34 v52.07,53.34 53.34,53.34 58.42,55.88 C8.1 60.96,55.88 66.04,53.34 v67.31,53.34 68.58,53.34 73.66,58.42 81.28,60.96 86.36,62.23 | C13.+ E5.14 30.48,35.56 35.56,33.02 38.1,33.02 43.18,35.56 E6.14 45.72,35.56 50.8,33.02 53.34,33.02 58.42,35.56 E7.14 | E12.14 76.2,105.41 77.47,104.14 77.47,91.44 76.2,90.17 D3.C

### Text on the board
Top: FLIP CHIP | DEC
Bottom: PUNCH CONTROL M710B
tNames: V1 | V1 | V1 | V1 | V1 | V1 | V1 | V1 | V1 | V1 | V1 | V1 | V1 | V1 | V1 | V1 | V1 | V1 | V1 | V1 | V1 | V1 | V1 | V1 | V1 | V1 | V1 | V1 | V1 | V1 | V1 | V1 | A1 | A1 | A1 | A1 | A1 | A1 | A1 | A1 | A1 | A1 | A1 | A1 | A1 | A1 | A1 | A1 | A1 | A1 | A1 | A1 | A1 | A1 | A1 | A1 | A1 | A1 | A1 | A1 | A1 | A1 | A1 | A1